# EAGLE design LumaFix64v1.2_sp (EAGLE 9.5.2)
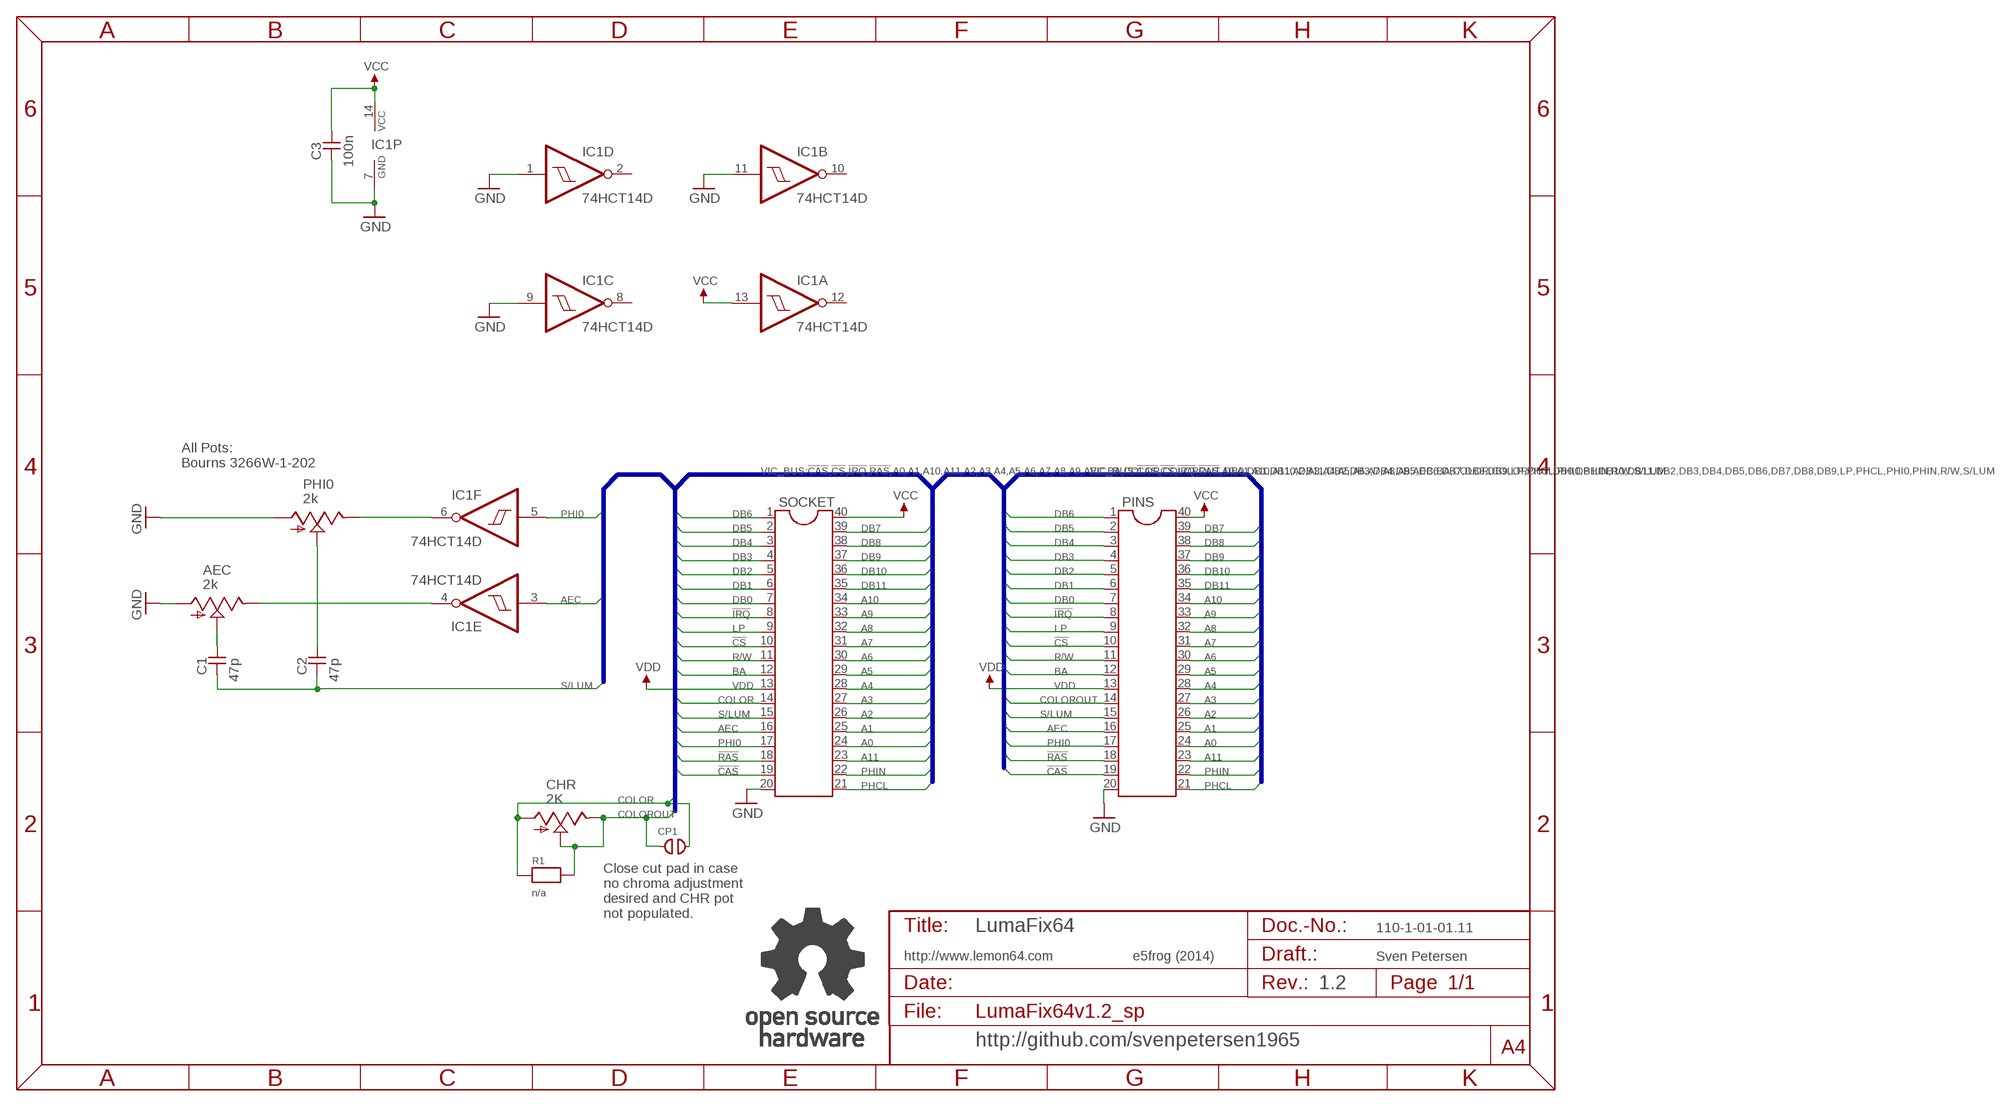
[diagram p0: schematic, sheet 1]

## Parts
AEC  2k  POT_TRIM_US-B64W  [POT_B64W]
C1  47p  C-0805  [0805]
C2  47p  C-0805  [0805]
C3  100n  C-0805  [0805]
CHR  2K  POT_TRIM_US-B64W  [POT_B64W]
CP1  OPEN  [CP_OP]
IC1  74HCT14D  [SO14]
PHI0  2k  POT_TRIM_US-B64W  [POT_B64W]
PINS  IC-PACKAGE_DIL40_10120540  [BLK_10120540_2X20]
R1  n/a  R-0805  [0805]
SOCKET  IC-PACKAGE_DIL40GS40P  [GS40P]
U$13  OPEN_SOURCE_HW  [OPENHW]

## Nets
!CAS: PINS.19 SOCKET.19
!CS: PINS.10 SOCKET.10
!IRQ: PINS.8 SOCKET.8
!RAS: PINS.18 SOCKET.18
A0: PINS.24 SOCKET.24
A1: PINS.25 SOCKET.25
A2: PINS.26 SOCKET.26
A3: PINS.27 SOCKET.27
A4: PINS.28 SOCKET.28
A5: PINS.29 SOCKET.29
A6: PINS.30 SOCKET.30
A7: PINS.31 SOCKET.31
A8: PINS.32 SOCKET.32
A9: PINS.33 SOCKET.33
A10: PINS.34 SOCKET.34
A11: PINS.23 SOCKET.23
AEC: IC1.3(E:I) PINS.16 SOCKET.16
BA: PINS.12 SOCKET.12
COLOR: CHR.A CP1.2 R1.1 SOCKET.14
COLOROUT: CHR.E CHR.S CP1.1 PINS.14 R1.2
DB0: PINS.7 SOCKET.7
DB1: PINS.6 SOCKET.6
DB2: PINS.5 SOCKET.5
DB3: PINS.4 SOCKET.4
DB4: PINS.3 SOCKET.3
DB5: PINS.2 SOCKET.2
DB6: PINS.1 SOCKET.1
DB7: PINS.39 SOCKET.39
DB8: PINS.38 SOCKET.38
DB9: PINS.37 SOCKET.37
DB10: PINS.36 SOCKET.36
DB11: PINS.35 SOCKET.35
GND: AEC.A C3.1 IC1.1(D:I) IC1.7(P:GND) IC1.9(C:I) IC1.11(B:I) PHI0.A PINS.20 SOCKET.20
LP: PINS.9 SOCKET.9
N$15: AEC.S C1.2
N$16: C2.2 PHI0.S
N$19: AEC.E IC1.4(E:O)
N$40: IC1.6(F:O) PHI0.E
PHCL: PINS.21 SOCKET.21
PHI0: IC1.5(F:I) PINS.17 SOCKET.17
PHIN: PINS.22 SOCKET.22
R/W: PINS.11 SOCKET.11
S/LUM: C1.1 C2.1 PINS.15 SOCKET.15
VCC: C3.2 IC1.13(A:I) IC1.14(P:VCC) PINS.40 SOCKET.40
VDD: PINS.13 SOCKET.13
Unconnected: IC1.2(D:O) IC1.8(C:O) IC1.10(B:O) IC1.12(A:O)

## Buses
VIC_BUS:!CAS,!CS,!IRQ,!RAS,A0,A1,A10,A11,A2,A3,A4,A5,A6,A7,A8,A9,AEC,BA,COLOR,COLOROUT,DB0,DB1,DB10,DB11,DB2,DB3,DB4,DB5,DB6,DB7,DB8,DB9,LP,PHCL,PHI0,PHIN,R/W,S/LUM

## Notes on the sheet
- All Pots: 
  Bourns 3266W-1-202
- Close cut pad in case
  no chroma adjustment
  desired and CHR pot
  not populated.
- LumaFix64 | 110-1-01-01.11
- http://www.lemon64.com | e5frog (2014) | Sven Petersen
- 1.2
- http://github.com/svenpetersen1965

## Library data of the parts
AEC CHR PHI0 = LumaFix64v1.0_B64W:POT_TRIM_US-: POTENTIOMETER
C1-C3 = SMD:C-0805
CP1 = Cutpad:OPEN: open Cutpad
IC1 = 74xx-eu:74*14: Hex schmitt trigger INVERTER
PINS SOCKET = LumaFix64v1.0_B64W:IC-PACKAGE_DIL40: Dual In Line
R1 = SMD:R-0805
U$13 = Logo:OPEN_SOURCE_HW

## Board
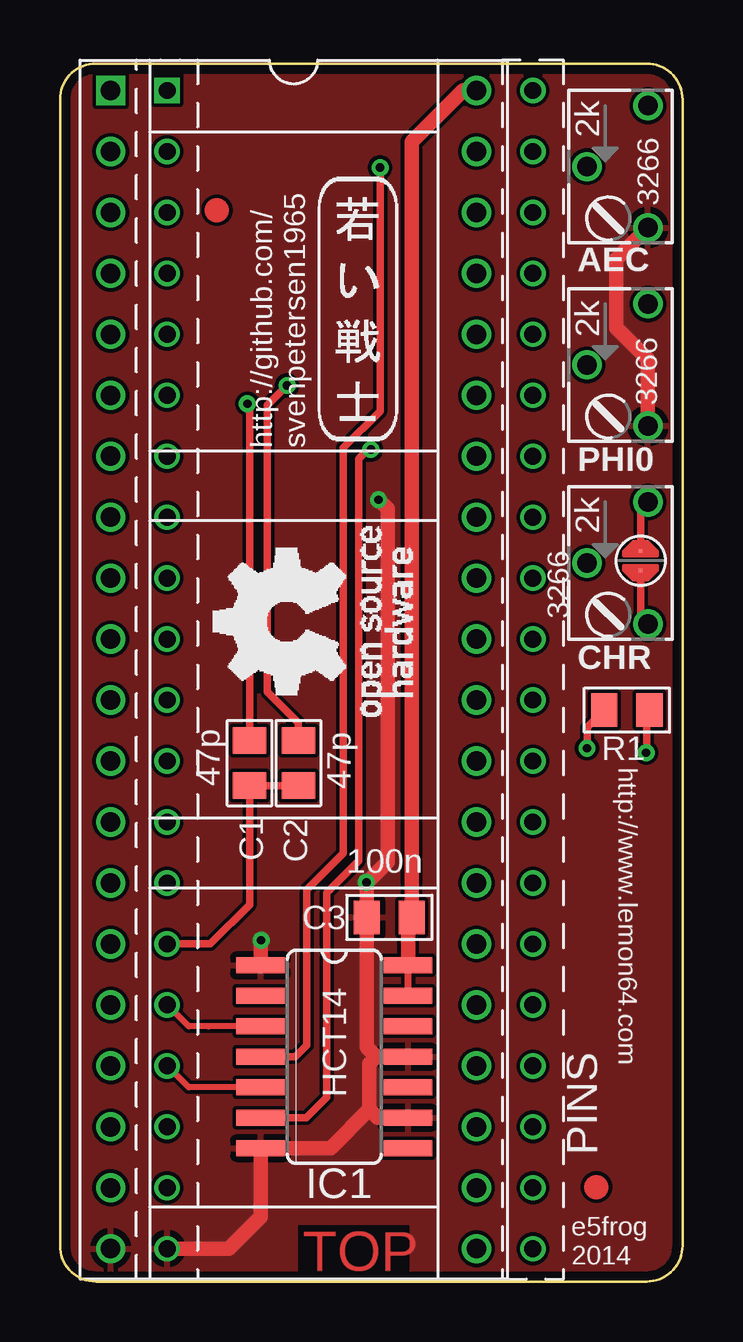
[diagram p1: board, top side]
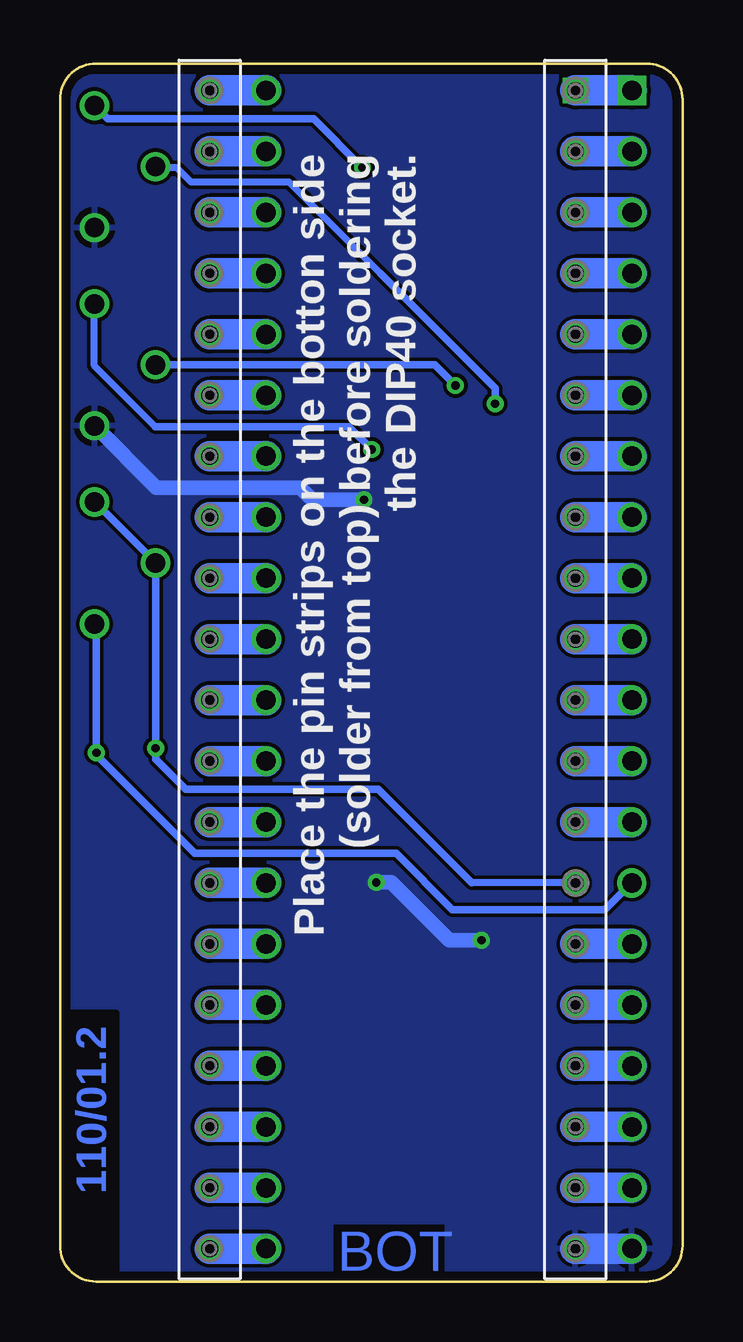
[diagram p2: board, bottom side, seen from below]

Size 25.94 x 50.75 mm. Coordinates in mm from the lower left corner, seen from the top.
Outline: 25.94,49.25 25.94,1.5 arc-90 24.44,0 1.5,0 arc-90 0,1.5 0,49.25 arc-90 1.5,50.75 24.44,50.75 arc-90 25.94,49.25
Copper layers (1*16): Top 0.0356mm / dielectric 1.5011mm / Bottom 0.0356mm
Design rules "oshpark *": minimum track width 6mil, minimum drill 13mil, track to track 6mil, track to pad 6mil, pad to pad 6mil, via to via 6mil, smd to smd 6mil, copper to edge 15mil, drill to drill 6mil, minimum pad ring 7mil, minimum via ring 7mil, stop-mask expansion 3mil, vias tented up to drill 0.6mm, thermal gap 10mil
bRestrict: 2 lines

### Footprints (pad centres in the part's own frame; a part is rotated, then mirrored left to right if it is on the bottom)
POT_B64W = drill 0.813: A 2.54,0; E -2.54,0; S 0,-2.54
0805 = smd 1.092 x 1.397: 1 -0.94,0; 2 0.94,0
CP_OP = smd 0.152 x 0.152: 1 -0.4,0; 2 0.4,0
SO14 = smd 0.66 x 2.032: 1 -3.81,-3.073; 2 -2.54,-3.073; 3 -1.27,-3.073; 4 0,-3.073; 5 1.27,-3.073; 6 2.54,-3.073; 7 3.81,-3.073; 8 3.81,3.073; 9 2.54,3.073; 10 1.27,3.073; 11 0,3.073; 12 -1.27,3.073; 13 -2.54,3.073; 14 -3.81,3.073
BLK_10120540_2X20 = drill 0.7 square: 1 -24.13,-7.62 | drill 0.7: 2 -21.59,-7.62; 3 -19.05,-7.62; 4 -16.51,-7.62; 5 -13.97,-7.62; 6 -11.43,-7.62; 7 -8.89,-7.62; 8 -6.35,-7.62; 9 -3.81,-7.62; 10 -1.27,-7.62; 11 1.27,-7.62; 12 3.81,-7.62; 13 6.35,-7.62; 14 8.89,-7.62; 15 11.43,-7.62; 16 13.97,-7.62; 17 16.51,-7.62; 18 19.05,-7.62; 19 21.59,-7.62; 20 24.13,-7.62; 21 24.13,7.62; 22 21.59,7.62; 23 19.05,7.62; 24 16.51,7.62; 25 13.97,7.62; 26 11.43,7.62; 27 8.89,7.62; 28 6.35,7.62; 29 3.81,7.62; 30 1.27,7.62; 31 -1.27,7.62; 32 -3.81,7.62; 33 -6.35,7.62; 34 -8.89,7.62; 35 -11.43,7.62; 36 -13.97,7.62; 37 -16.51,7.62; 38 -19.05,7.62; 39 -21.59,7.62; 40 -24.13,7.62
GS40P = drill 0.813 square: 1 -24.13,-7.62 | drill 0.813: 2 -21.59,-7.62; 3 -19.05,-7.62; 4 -16.51,-7.62; 5 -13.97,-7.62; 6 -11.43,-7.62; 7 -8.89,-7.62; 8 -6.35,-7.62; 9 -3.81,-7.62; 10 -1.27,-7.62; 11 1.27,-7.62; 12 3.81,-7.62; 13 6.35,-7.62; 14 8.89,-7.62; 15 11.43,-7.62; 16 13.97,-7.62; 17 16.51,-7.62; 18 19.05,-7.62; 19 21.59,-7.62; 20 24.13,-7.62; 21 24.13,7.62; 22 21.59,7.62; 23 19.05,7.62; 24 16.51,7.62; 25 13.97,7.62; 26 11.43,7.62; 27 8.89,7.62; 28 6.35,7.62; 29 3.81,7.62; 30 1.27,7.62; 31 -1.27,7.62; 32 -3.81,7.62; 33 -6.35,7.62; 34 -8.89,7.62; 35 -11.43,7.62; 36 -13.97,7.62; 37 -16.51,7.62; 38 -19.05,7.62; 39 -21.59,7.62; 40 -24.13,7.62

### Placement (x,y rotation side)
AEC  24.5,46.45 270 top
C1  7.9,21.61 90 top
C2  9.93,21.61 90 top
C3  13.72,15.18 0 top
CHR  24.5,29.95 270 top
CP1  24.19,30.04 270 top
IC1  11.43,9.37 270 top
PHI0  24.5,38.2 270 top
PINS  12.08,25.5 270 top
R1  23.62,23.81 180 top
SOCKET  9.73,25.5 270 top
U$7  [2LAYER]  10.1,0.44 0 top
U$9  [PCB-TITLE/]  0,53.91 0 top  (outside the outline)
U$10  [SMD_REF_R1MM]  22.35,3.94 0 top
U$11  [SMD_REF_R1MM]  6.54,44.64 0 top
U$12  [SVEN_TAG]  12.45,40.64 0 top
U$13  14.67,23.56 90 top

### Tracks (layer width: path | path; a pad name or v marks a point on that pad's centre or on a via)
!CAS
  Bottom 1.27: SOCKET.19 PINS.19
!CS
  Bottom 1.27: SOCKET.10 PINS.10
!IRQ
  Bottom 1.27: SOCKET.8 PINS.8
!RAS
  Bottom 1.27: SOCKET.18 PINS.18
A0
  Bottom 1.27: SOCKET.24 PINS.24
A1
  Bottom 1.27: SOCKET.25 PINS.25
A2
  Bottom 1.27: SOCKET.26 PINS.26
A3
  Bottom 1.27: SOCKET.27 PINS.27
A4
  Bottom 1.27: SOCKET.28 PINS.28
A5
  Bottom 1.27: SOCKET.29 PINS.29
A6
  Bottom 1.27: SOCKET.30 PINS.30
A7
  Bottom 1.27: SOCKET.31 PINS.31
A8
  Bottom 1.27: SOCKET.32 PINS.32
A9
  Bottom 1.27: SOCKET.33 PINS.33
A10
  Bottom 1.27: SOCKET.34 PINS.34
A11
  Bottom 1.27: SOCKET.23 PINS.23
AEC
  Top 0.254: IC1.3 6.18,10.64 5.37,10.64 4.45,11.56 PINS.16
  Bottom 1.27: SOCKET.16 PINS.16
BA
  Bottom 1.27: SOCKET.12 PINS.12
COLOR  (via drill 0.35)
  Top 0.305: CP1.2 24.19,27.71 CHR.A | R1.1 24.45,23.7 24.45,21.97 24.42,22 v24.42,22.04
  Bottom 0.305: SOCKET.14 2.12,16.61 3.24,15.49 9.59,15.49 11.94,17.84 20.32,17.84 24.42,21.95 v24.42,22.04 24.42,27.33 | 24.38,27.29 24.42,27.33 | 24.42,27.33 CHR.A
COLOROUT  (via drill 0.35)
  Top 0.305: CP1.1 24.19,32.18 CHR.E | R1.2 21.97,23.1 v21.97,22.23 v21.96,22.23
  Bottom 0.3: PINS.14 8.78,16.61
  Bottom 0.305: 8.78,16.61 12.68,20.51 20.7,20.51 21.96,21.77 v21.96,22.23 CHR.S CHR.E
DB0
  Bottom 1.27: SOCKET.7 PINS.7
DB1
  Bottom 1.27: SOCKET.6 PINS.6
DB2
  Bottom 1.27: SOCKET.5 PINS.5
DB3
  Bottom 1.27: SOCKET.4 PINS.4
DB4
  Bottom 1.27: SOCKET.3 PINS.3
DB5
  Bottom 1.27: SOCKET.2 PINS.2
DB6
  Bottom 1.27: SOCKET.1 PINS.1
DB7
  Bottom 1.27: SOCKET.39 PINS.39
DB8
  Bottom 1.27: SOCKET.38 PINS.38
DB9
  Bottom 1.27: SOCKET.37 PINS.37
DB10
  Bottom 1.27: SOCKET.36 PINS.36
DB11
  Bottom 1.27: SOCKET.35 PINS.35
GND  (via drill 0.35)
  Top 0.61: PINS.20 7.02,1.37 8.36,2.71 IC1.7 11.27,5.56 12.89,7.18 | IC1.9 13.24,6.83 12.89,7.18 | 12.89,7.18 12.89,9.08 13.18,9.37 | 13.18,9.37 IC1.11 | 12.78,16.62 C3.1 12.78,9.77 13.18,9.37 | 12.78,16.62 v12.76,16.64 | v8.38,14.22 8.36,14.2 IC1.1 | 12.78,16.62 13.65,17.5 13.65,32.19 v13.27,32.58 | PHI0.A 24.5,38.43 23.18,39.75 23.18,42.59 AEC.A
  Bottom 0.61: v12.76,16.64 12.13,16.64 9.72,14.22 v8.38,14.22 | v13.27,32.58 15.43,32.58 15.94,33.08 21.92,33.08 PHI0.A
  Bottom 1.27: SOCKET.20 PINS.20
  pour Bottom: 25.93,49.4 25.93,1.5 arc-90 24.43,0 1.66,0 arc-90 0,1.5 0,49.4 arc-90 1.66,50.75 24.43,50.75 arc-90
  pour Top: 25.93,49.25 25.93,1.5 arc-90 24.43,0 1.66,0 arc-90 0,1.5 0,49.25 arc-90 1.5,50.75 24.43,50.75 arc-90
LP
  Bottom 1.27: SOCKET.9 PINS.9
N$15  (via drill 0.35)
  Top 0.305: C1.2 7.9,36.49 v7.81,36.58
  Bottom 0.3: 12.59,42.01 16.4,45.82 20.48,45.82 21.08,46.42 21.92,46.42 AEC.S
  Bottom 0.305: 12.59,42.01 7.81,37.23 v7.81,36.58 7.81,36.45
N$16  (via drill 0.35)
  Top 0.305: C2.2 9.93,23.28 8.64,24.57 8.64,36.51 v9.46,37.34
  Bottom 0.305: PHI0.S 10.32,38.2 v9.46,37.34
N$19  (via drill 0.35)
  Top 0.305: IC1.4 9.81,9.37 10.29,9.84 10.29,16.32 11.81,17.84 11.81,34.73 13.34,36.26 v13.34,46.42
  Bottom 0.305: v13.34,46.42 15.37,48.45 23.95,48.45 AEC.E
N$40  (via drill 0.35)
  Top 0.305: IC1.6 10.26,6.83 11.11,7.68 11.11,16.19 12.45,17.53 12.45,34.29 12.83,34.67 v12.95,34.67
  Bottom 0.3: 21.97,35.62 24.51,38.16 24.51,40.73 PHI0.E
  Bottom 0.305: v12.95,34.67 13.91,35.62 21.97,35.62
PHCL
  Bottom 1.27: SOCKET.21 PINS.21
PHI0
  Top 0.254: IC1.5 5.37,8.1 4.45,9.02 PINS.17
  Bottom 0.254: 4.51,9.02 PINS.17
  Bottom 1.27: SOCKET.17 PINS.17
PHIN
  Bottom 1.27: SOCKET.22 PINS.22
R/W
  Bottom 1.27: SOCKET.11 PINS.11
S/LUM
  Top 0.305: PINS.15 6.26,14.07 7.9,15.71 C1.1 C2.1
  Bottom 1.27: SOCKET.15 PINS.15
VCC
  Top 0.3: 13.81,13.18 IC1.14 IC1.13
  Top 0.61: IC1.14 14.5,15.02 C3.2 14.66,47.48 16.8,49.63 SOCKET.40
  Bottom 1.27: SOCKET.40 PINS.40
VDD
  Bottom 1.27: SOCKET.13 PINS.13

### Text on the board
Bottom: 110/01.2
tPlace: 2k | 3266 | 2k | 3266 | http://github.com/ / svenpetersen1965 | 2k | 3266 | 47p | 47p | http://www.lemon64.com | 100n | HCT14 | e5frog / 2014
bPlace: Place the pin strips on the botton side / (solder from top) before soldering / the DIP40 socket.
tStop: LumaFix64 v1.2sp
Document: 110-2-01-01.2 | LumaFix64 | http://www.lemon64.com | 35µm | 2 | /e5frog | 1.2